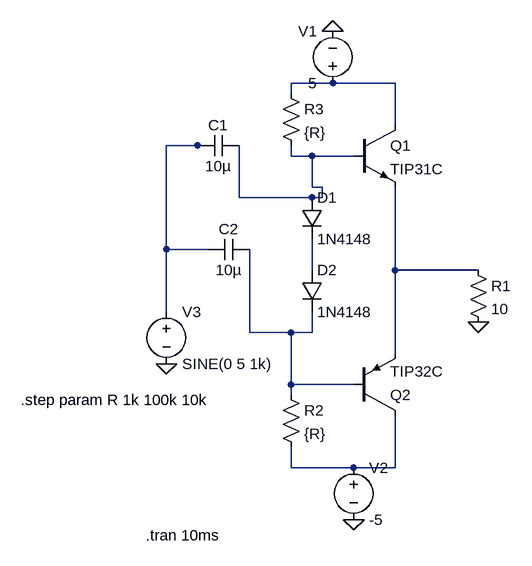
[diagram p0: schematic power amp.asc]
power amp.asc, the LTspice schematic file:
Version 4
SHEET 1 980 760
WIRE 176 48 112 48
WIRE 272 48 176 48
WIRE 112 64 112 48
WIRE 272 112 272 48
WIRE -32 144 -80 144
WIRE -16 144 -32 144
WIRE 112 160 112 144
WIRE 144 160 112 160
WIRE 208 160 144 160
WIRE 144 208 144 160
WIRE 160 208 144 208
WIRE 32 224 32 144
WIRE 144 224 32 224
WIRE 160 224 160 208
WIRE 160 224 144 224
WIRE -80 304 -80 144
WIRE -16 304 -80 304
WIRE 144 336 144 288
WIRE 272 336 272 208
WIRE 400 336 272 336
WIRE -80 400 -80 304
WIRE 48 432 48 304
WIRE 112 432 48 432
WIRE 144 432 144 400
WIRE 144 432 112 432
WIRE 272 464 272 336
WIRE 112 512 112 432
WIRE 208 512 112 512
WIRE 112 528 112 512
WIRE 112 640 112 608
WIRE 208 640 112 640
WIRE 272 640 272 560
WIRE 272 640 208 640
FLAG -80 480 0
FLAG 176 -32 0
FLAG 208 720 0
FLAG 400 416 0
SYMBOL voltage -80 384 R0
WINDOW 123 0 0 Left 0
WINDOW 39 0 0 Left 0
SYMATTR InstName V3
SYMATTR Value SINE(0 5 1k)
SYMBOL npn 208 112 R0
SYMATTR InstName Q1
SYMATTR Value TIP31C
SYMBOL pnp 208 560 M180
SYMATTR InstName Q2
SYMATTR Value TIP32C
SYMBOL voltage 176 64 R180
WINDOW 0 24 96 Left 2
WINDOW 3 24 16 Left 2
WINDOW 123 0 0 Left 0
WINDOW 39 0 0 Left 0
SYMATTR InstName V1
SYMATTR Value 5
SYMBOL voltage 208 624 R0
WINDOW 123 0 0 Left 0
WINDOW 39 0 0 Left 0
SYMATTR InstName V2
SYMATTR Value -5
SYMBOL res 384 320 R0
SYMATTR InstName R1
SYMATTR Value 10
SYMBOL res 96 512 R0
SYMATTR InstName R2
SYMATTR Value {R}
SYMBOL res 96 48 R0
SYMATTR InstName R3
SYMATTR Value {R}
SYMBOL cap 32 128 R90
WINDOW 0 0 32 VBottom 2
WINDOW 3 32 32 VTop 2
SYMATTR InstName C1
SYMATTR Value 10µ
SYMBOL cap 48 288 R90
WINDOW 0 0 32 VBottom 2
WINDOW 3 32 32 VTop 2
SYMATTR InstName C2
SYMATTR Value 10µ
SYMBOL diode 128 224 R0
SYMATTR InstName D1
SYMATTR Value 1N4148
SYMBOL diode 128 336 R0
SYMATTR InstName D2
SYMATTR Value 1N4148
TEXT -112 744 Left 2 !.tran 10ms
TEXT -304 536 Left 2 !.step param R 1k 100k 10k

The netlist it stands for:
* power amp.asc
V3 N002 0 SINE(0 5 1k)
Q1 N001 N003 N005 0 TIP31C
Q2 N007 N006 N005 0 TIP32C
V1 N001 0 5
V2 N007 0 -5
R1 N005 0 10
R2 N006 N007 {R}
R3 N001 N003 {R}
C1 N003 N002 10µ
C2 N006 N002 10µ
D1 N003 N004 1N4148
D2 N004 N006 1N4148
.model D D
.lib standard.dio
.model NPN NPN
.model PNP PNP
.lib standard.bjt
.tran 10ms
.step param R 1k 100k 10k
.backanno
.end